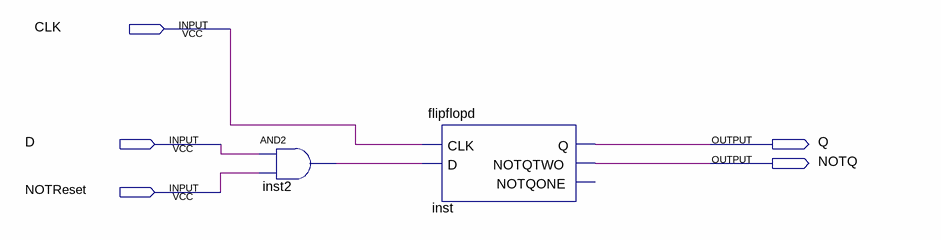
[diagram p0: schematic sheet]
// Quartus schematic resetableflipflop.bdf as structural Verilog: 2 symbols, 5 pins
module resetableflipflop (
  input  CLK,
  input  D,
  input  NOTReset,
  output Q,
  output NOTQ
);

  wire inst2_out;

  and inst2 (inst2_out, D, NOTReset);
  flipflopd inst (.CLK(CLK), .D(inst2_out), .Q(Q), .NOTQTWO(NOTQ));  // open: NOTQONE
endmodule
